# EAGLE schematic reference_module (EAGLE 6.1)
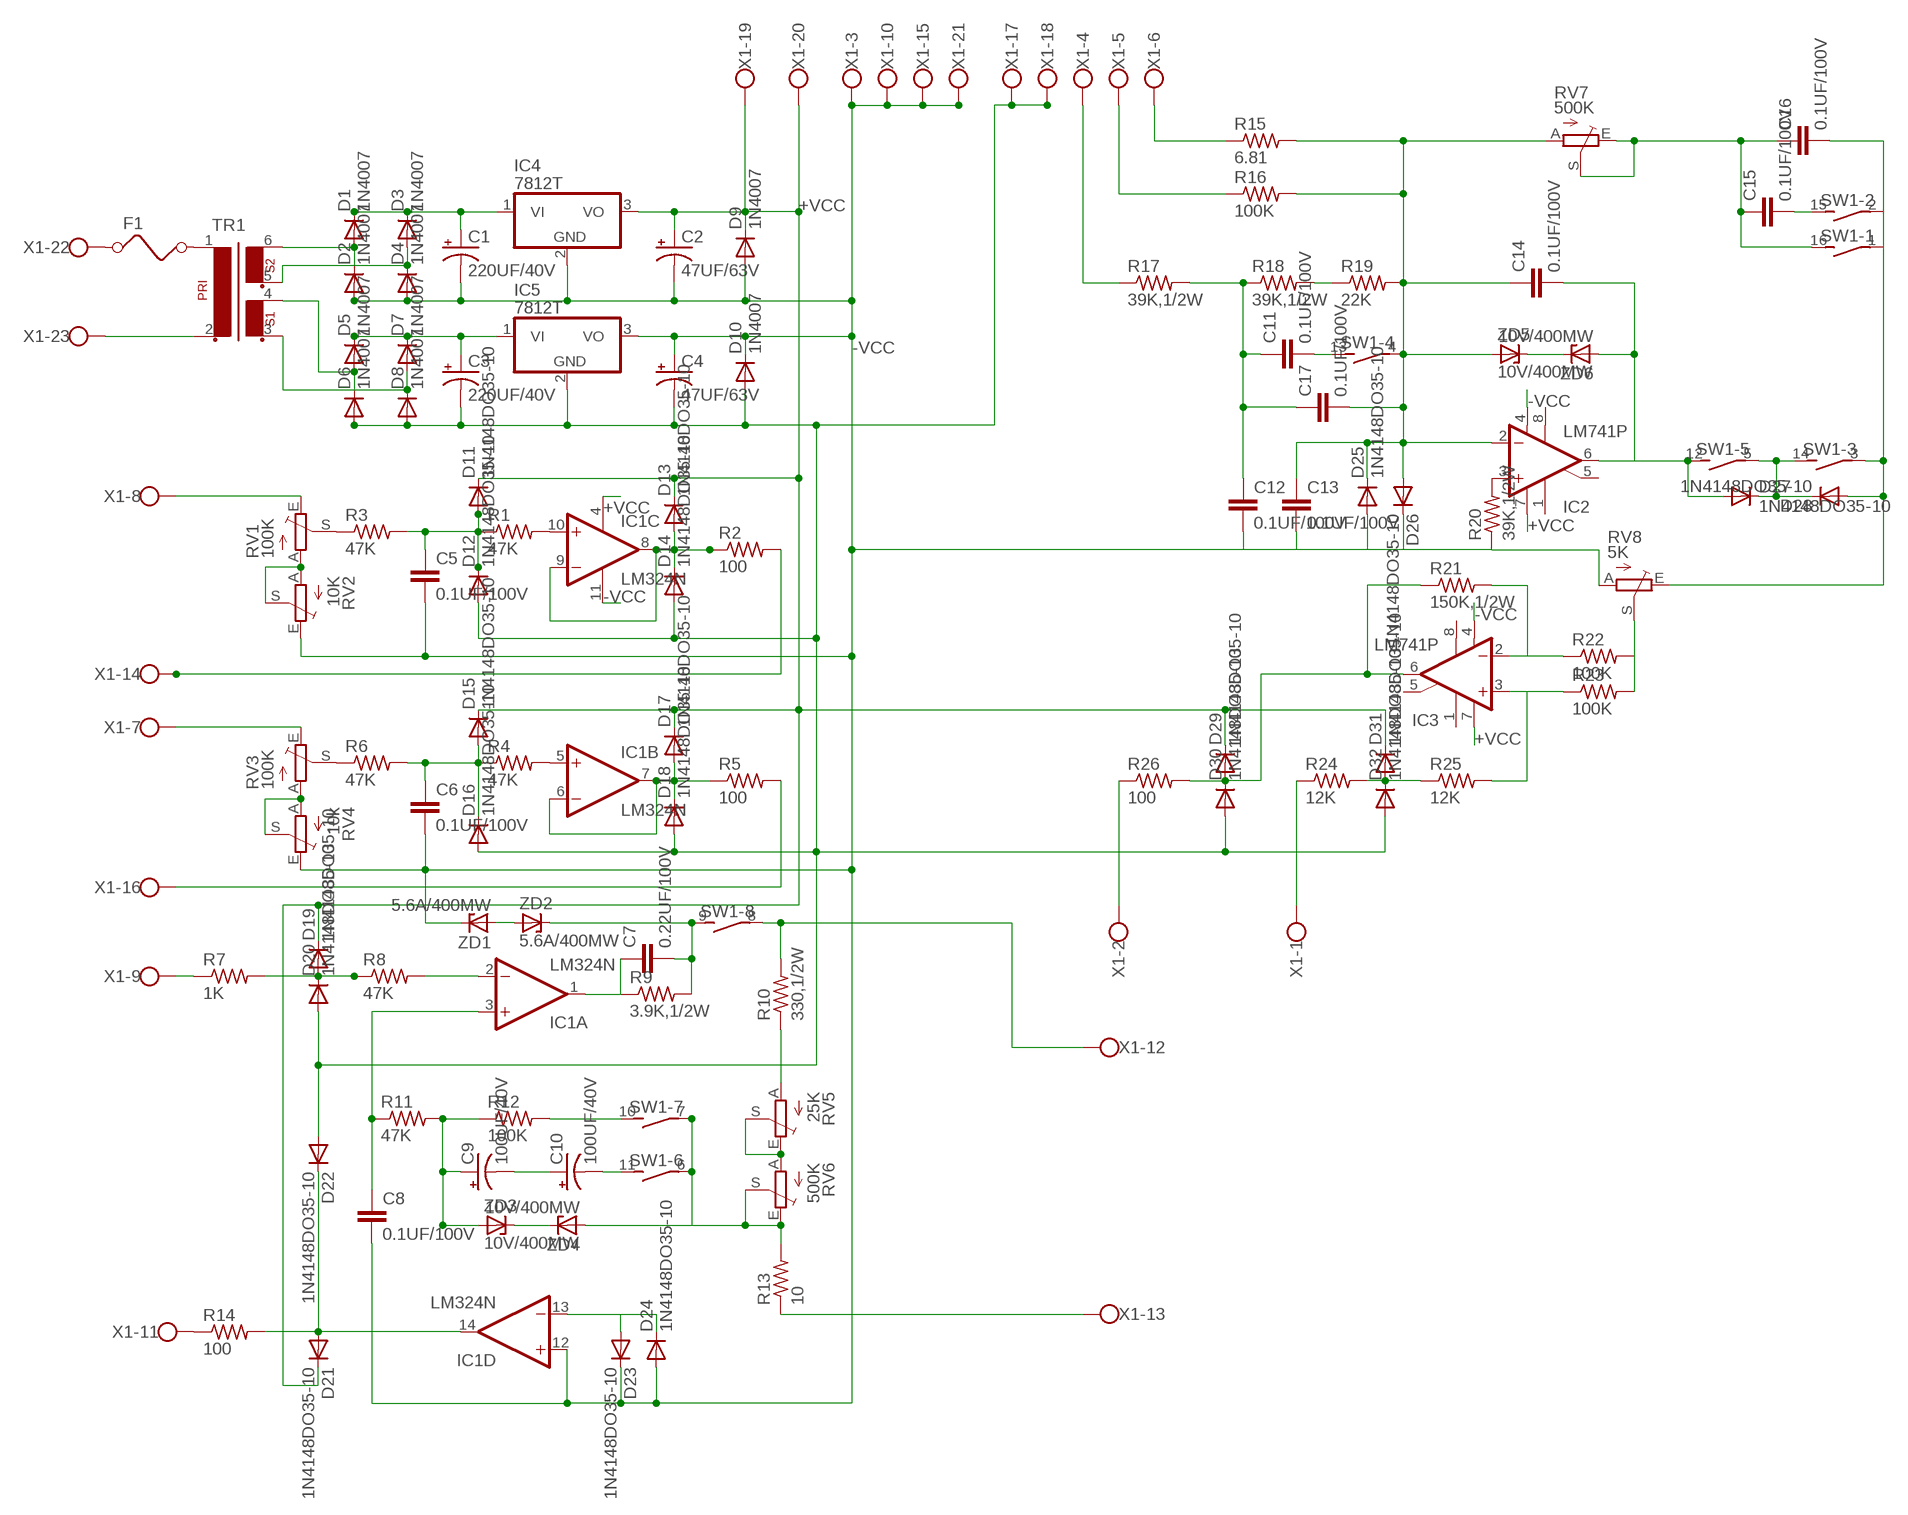
[diagram p0: schematic, sheet 1]

## Parts
C1  220UF/40V  CPOL-USE3.5-10  [E3,5-10]
C2  47UF/63V  CPOL-USE3.5-10  [E3,5-10]
C3  220UF/40V  CPOL-USE3.5-10  [E3,5-10]
C4  47UF/63V  CPOL-USE3.5-10  [E3,5-10]
C5  0.1UF/100V  C-EU102-054X133  [C102-054X133]
C6  0.1UF/100V  C-EU102-054X133  [C102-054X133]
C7  0.22UF/100V  C-EU102-054X133  [C102-054X133]
C8  0.1UF/100V  C-EU102-054X133  [C102-054X133]
C9  100UF/40V  CPOL-USE3.5-10  [E3,5-10]
C10  100UF/40V  CPOL-USE3.5-10  [E3,5-10]
C11  0.1UF/100V  C-EU102-054X133  [C102-054X133]
C12  0.1UF/100V  C-EU102-054X133  [C102-054X133]
C13  0.1UF/100V  C-EU102-054X133  [C102-054X133]
C14  0.1UF/100V  C-EU102-054X133  [C102-054X133]
C15  0.1UF/100V  C-EU102-054X133  [C102-054X133]
C16  0.1UF/100V  C-EU102-054X133  [C102-054X133]
C17  0.1UF/100V  C-EU102-054X133  [C102-054X133]
D1  1N4007  1N4004  [DO41-10]
D2  1N4007  1N4004  [DO41-10]
D3  1N4007  1N4004  [DO41-10]
D4  1N4007  1N4004  [DO41-10]
D5  1N4007  1N4004  [DO41-10]
D6  1N4007  1N4004  [DO41-10]
D7  1N4007  1N4004  [DO41-10]
D8  1N4007  1N4004  [DO41-10]
D9  1N4007  1N4004  [DO41-10]
D10  1N4007  1N4004  [DO41-10]
D11  1N4148DO35-10  [DO35-10]
D12  1N4148DO35-10  [DO35-10]
D13  1N4148DO35-10  [DO35-10]
D14  1N4148DO35-10  [DO35-10]
D15  1N4148DO35-10  [DO35-10]
D16  1N4148DO35-10  [DO35-10]
D17  1N4148DO35-10  [DO35-10]
D18  1N4148DO35-10  [DO35-10]
D19  1N4148DO35-10  [DO35-10]
D20  1N4148DO35-10  [DO35-10]
D21  1N4148DO35-10  [DO35-10]
D22  1N4148DO35-10  [DO35-10]
D23  1N4148DO35-10  [DO35-10]
D24  1N4148DO35-10  [DO35-10]
D25  1N4148DO35-10  [DO35-10]
D26  1N4148DO35-10  [DO35-10]
D27  1N4148DO35-10  [DO35-10]
D28  1N4148DO35-10  [DO35-10]
D29  1N4148DO35-10  [DO35-10]
D30  1N4148DO35-10  [DO35-10]
D31  1N4148DO35-10  [DO35-10]
D32  1N4148DO35-10  [DO35-10]
F1  FUSE  [FUSE]
IC1  LM324N  [DIL14]
IC2  LM741P  [DIL08]
IC3  LM741P  [DIL08]
IC4  7812T  [TO220H]
IC5  7812T  [TO220H]
R1  47K  R-US_0207/10  [0207/10]
R2  100  R-US_0207/10  [0207/10]
R3  47K  R-US_0207/10  [0207/10]
R4  47K  R-US_0207/10  [0207/10]
R5  100  R-US_0207/10  [0207/10]
R6  47K  R-US_0207/10  [0207/10]
R7  1K  R-US_0207/10  [0207/10]
R8  47K  R-US_0207/10  [0207/10]
R9  3.9K,1/2W  R-US_0207/10  [0207/10]
R10  330,1/2W  R-US_0207/10  [0207/10]
R11  47K  R-US_0207/10  [0207/10]
R12  100K  R-US_0207/10  [0207/10]
R13  10  R-US_0207/10  [0207/10]
R14  100  R-US_0207/10  [0207/10]
R15  6.81  R-US_0207/10  [0207/10]
R16  100K  R-US_0207/10  [0207/10]
R17  39K,1/2W  R-US_0207/10  [0207/10]
R18  39K,1/2W  R-US_0207/10  [0207/10]
R19  22K  R-US_0207/10  [0207/10]
R20  39K,1/2W  R-US_0207/10  [0207/10]
R21  150K,1/2W  R-US_0207/10  [0207/10]
R22  100K  R-US_0207/10  [0207/10]
R23  100K  R-US_0207/10  [0207/10]
R24  12K  R-US_0207/10  [0207/10]
R25  12K  R-US_0207/10  [0207/10]
R26  100  R-US_0207/10  [0207/10]
RV1  100K  TRIM_EU-S63P  [S63P]
RV2  10K  TRIM_EU-S63P  [S63P]
RV3  100K  TRIM_EU-S63P  [S63P]
RV4  10k  TRIM_EU-S63P  [S63P]
RV5  25K  TRIM_EU-S63P  [S63P]
RV6  500K  TRIM_EU-S63P  [S63P]
RV7  500K  TRIM_EU-S63P  [S63P]
RV8  5K  TRIM_EU-S63P  [S63P]
SW1  DIP08S  [DIP08S]
TR1  VR2230-2  [VR22-2]
X1  W237-6  [W237-6]
ZD1  5.6A/400MW  ZENER-DIODEZD-10  [ZDIO-10]
ZD2  5.6A/400MW  ZENER-DIODEZD-10  [ZDIO-10]
ZD3  10V/400MW  ZENER-DIODEZD-10  [ZDIO-10]
ZD4  10V/400MW  ZENER-DIODEZD-10  [ZDIO-10]
ZD5  10V/400MW  ZENER-DIODEZD-10  [ZDIO-10]
ZD6  10V/400MW  ZENER-DIODEZD-10  [ZDIO-10]

## Nets
+VCC: C2.+ D9.C D11.C D13.C D15.C D17.C D19.C D21.C D29.C D31.C IC1.4(P:V+) IC2.7(V+) IC3.7(V+) IC4.3(VO) X1.19 X1.20
-VCC: C1.- C2.- C4.+ C5.2 C6.2 C8.2 C12.2 C13.2 D2.A D4.A D9.A D10.C D23.C D24.A D25.A D26.C IC1.11(P:V-) IC1.12(D:+IN) IC2.4(V-) IC3.4(V-) IC4.2(GND) IC5.3(VO) R20.1 RV2.E RV4.E RV8.A X1.3 X1.10 X1.15 X1.21 ZD1.C
N$1: D1.A D2.C TR1.6
N$2: D3.A D4.C TR1.5
N$3: D5.A D6.C TR1.4
N$4: D7.A D8.C TR1.3
N$5: C1.+ D1.C D3.C IC4.1(VI)
N$6: RV1.A RV2.A RV2.S
N$7: C3.+ D5.C D7.C IC5.1(VI)
N$8: RV3.A RV4.A RV4.S
N$9: R7.1 X1.9
N$11: RV1.E X1.8
N$12: R3.1 RV1.S
N$13: C5.1 D11.A D12.C R1.1 R3.2
N$14: F1.1 X1.22
N$15: TR1.2 X1.23
N$16: IC1.10(C:+IN) R1.2
N$17: D13.A D14.C IC1.8(C:OUT) IC1.9(C:-IN) R2.1
N$18: R6.1 RV3.S
N$19: C3.- C4.- D6.A D8.A D10.A D12.A D14.A D16.A D18.A D20.A D22.A D30.A D32.A IC5.2(GND) X1.17 X1.18
N$20: R2.2 X1.14
N$21: C6.1 D15.A D16.C R4.1 R6.2
N$22: D19.A D20.C R7.2 R8.1
N$23: IC1.5(B:+IN) R4.2
N$24: D17.A D18.C IC1.6(B:-IN) IC1.7(B:OUT) R5.1
N$25: IC1.2(A:-IN) R8.2
N$27: RV3.E X1.7
N$28: R5.2 X1.16
N$29: ZD1.A ZD2.A
N$30: C7.1 IC1.1(A:OUT) R9.1
N$31: C7.2 R9.2 SW1.9 ZD2.C
N$32: R10.2 SW1.8 X1.12
N$33: R10.1 RV5.A
N$34: RV5.E RV5.S RV6.A
N$35: C9.+ R11.2 R12.1 ZD3.A
N$36: R14.1 X1.11
N$37: C8.1 IC1.3(A:+IN) R11.1
N$38: R12.2 SW1.10
N$39: C9.- C10.+
N$40: C10.- SW1.11
N$41: R13.2 RV6.E RV6.S SW1.6 SW1.7 ZD4.A
N$42: ZD3.C ZD4.C
N$43: D23.A D24.C IC1.13(D:-IN)
N$44: D21.A D22.C IC1.14(D:OUT) R14.2
N$45: R13.1 X1.13
N$46: IC2.3(+IN) R20.2
N$47: C15.2 SW1.15
N$48: C11.1 C12.1 C17.1 R17.2 R18.1
N$49: C11.2 SW1.13
N$50: R18.2 R19.1
N$51: R15.1 X1.6
N$52: R16.1 X1.5
N$53: R17.1 X1.4
N$54: C13.1 C14.1 C17.2 D25.C D26.A IC2.2(-IN) R15.2 R16.2 R19.2 RV7.A SW1.4 ZD5.A
N$55: C15.1 C16.1 RV7.E RV7.S SW1.16
N$57: D27.C D28.C SW1.5 SW1.14
N$58: F1.2 TR1.1
N$59: C14.2 D27.A IC2.6(OUT) SW1.12 ZD6.A
N$60: ZD5.C ZD6.C
N$61: R22.2 R23.2 RV8.S
N$62: IC3.2(-IN) R21.2 R22.1
N$63: IC3.3(+IN) R23.1 R25.2
N$64: D29.A D30.C IC3.6(OUT) R21.1 R26.2
N$65: D31.A D32.C R24.2 R25.1
N$66: R26.1 X1.2
N$67: R24.1 X1.1
N$68: C16.2 D28.A RV8.E SW1.1 SW1.2 SW1.3
Unconnected: IC2.1(ON1) IC2.5(ON2) IC2.8(OPT) IC3.1(ON1) IC3.5(ON2) IC3.8(OPT)

## Library data of the parts
C1-C4 C9 C10 = amit_rcl:CPOL-US: POLARIZED CAPACITOR, American symbol
C5-C8 C11-C17 = amit_rcl:C-EU: CAPACITOR, European symbol
D1-D10 = amit_diode_1N4004:1N4004: DIODE general purpose rectifier, 1 A
D11-D32 = diode:1N4148: DIODE high speed (Philips)
F1 = special:FUSE: FUSE 5 x 20 mm
IC1 = linear:LM324: OP AMP
IC2 IC3 = amit_linear_OP_AMP:*741: OP AMP
IC4 IC5 = linear:78*: Positive VOLTAGE REGULATOR Source: http://cache.national.com/ds/LM/LM78L05.pdf http://www.fairchildsemi.com/ds/LM/LM7805.pdf
R1-R26 = amit_rcl:R-US_: RESISTOR, American symbol
RV1-RV8 = pot:TRIM_EU-: POTENTIOMETER
SW1 = switch-dil:DIP08S: DIL/CODE SWITCH; OC_FARNELL: unknown; OC_NEWARK: unknown
TR1 = trafo:VR2230-2: TRANSFORMER 1 primary winding, 2 secondary windings, mounting holes BLOCK
X1 = amit_screw_terminal_23:W237-6: WAGO SCREW CLAMP; OC_FARNELL: unknown; OC_NEWARK: unknown
ZD1-ZD6 = amit_diode_1N4004:ZENER-DIODE: Z-Diode